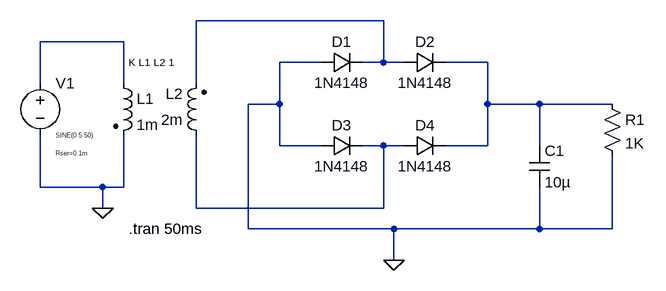
[diagram p0: schematic Full wave Rectifier.asc]
Full wave Rectifier.asc, the LTspice schematic file:
Version 4
SHEET 1 880 680
WIRE 208 48 -80 48
WIRE -192 80 -320 80
WIRE 112 112 48 112
WIRE 208 112 208 48
WIRE 208 112 176 112
WIRE 240 112 208 112
WIRE 368 112 304 112
WIRE -320 144 -320 80
WIRE -192 144 -192 80
WIRE -80 144 -80 48
WIRE 48 176 48 112
WIRE 48 176 0 176
WIRE 368 176 368 112
WIRE 448 176 368 176
WIRE 560 176 448 176
WIRE 48 240 48 176
WIRE 112 240 48 240
WIRE 208 240 176 240
WIRE 240 240 208 240
WIRE 368 240 368 176
WIRE 368 240 304 240
WIRE 448 240 448 176
WIRE -320 304 -320 224
WIRE -224 304 -320 304
WIRE -192 304 -192 224
WIRE -192 304 -224 304
WIRE -224 336 -224 304
WIRE -80 336 -80 224
WIRE 208 336 208 240
WIRE 208 336 -80 336
WIRE 0 368 0 176
WIRE 224 368 0 368
WIRE 448 368 448 304
WIRE 448 368 224 368
WIRE 560 368 560 256
WIRE 560 368 448 368
WIRE 224 416 224 368
FLAG 224 416 0
FLAG -224 336 0
SYMBOL diode 112 128 R270
WINDOW 0 32 32 VTop 2
WINDOW 3 0 32 VBottom 2
SYMATTR InstName D1
SYMATTR Value 1N4148
SYMBOL diode 240 128 R270
WINDOW 0 32 32 VTop 2
WINDOW 3 0 32 VBottom 2
SYMATTR InstName D2
SYMATTR Value 1N4148
SYMBOL diode 112 256 R270
WINDOW 0 32 32 VTop 2
WINDOW 3 0 32 VBottom 2
SYMATTR InstName D3
SYMATTR Value 1N4148
SYMBOL diode 240 256 R270
WINDOW 0 32 32 VTop 2
WINDOW 3 0 32 VBottom 2
SYMATTR InstName D4
SYMATTR Value 1N4148
SYMBOL voltage -320 128 R0
WINDOW 3 24 96 Left 0
WINDOW 123 0 0 Left 0
WINDOW 39 24 124 Left 0
SYMATTR InstName V1
SYMATTR Value SINE(0 5 50)
SYMATTR SpiceLine Rser=0.1m
SYMBOL ind2 -208 128 R0
SYMATTR InstName L1
SYMATTR Value 1m
SYMATTR Type ind
SYMBOL ind2 -64 240 R180
WINDOW 0 36 80 Left 2
WINDOW 3 36 40 Left 2
SYMATTR InstName L2
SYMATTR Value 2m
SYMATTR Type ind
SYMBOL res 544 160 R0
SYMATTR InstName R1
SYMATTR Value 1K
SYMBOL cap 432 240 R0
SYMATTR InstName C1
SYMATTR Value 10µ
TEXT -184 112 Left 1 !K L1 L2 1
TEXT -184 368 Left 2 !.tran 50ms

The netlist it stands for:
* Full wave Rectifier.asc
D1 0 N001 1N4148
D2 N001 N003 1N4148
D3 0 N004 1N4148
D4 N004 N003 1N4148
V1 N002 0 SINE(0 5 50) Rser=0.1m
L1 N002 0 1m
L2 N004 N001 2m
R1 N003 0 1K
C1 N003 0 10µ
.model D D
.lib standard.dio
K L1 L2 1
.tran 50ms
.backanno
.end